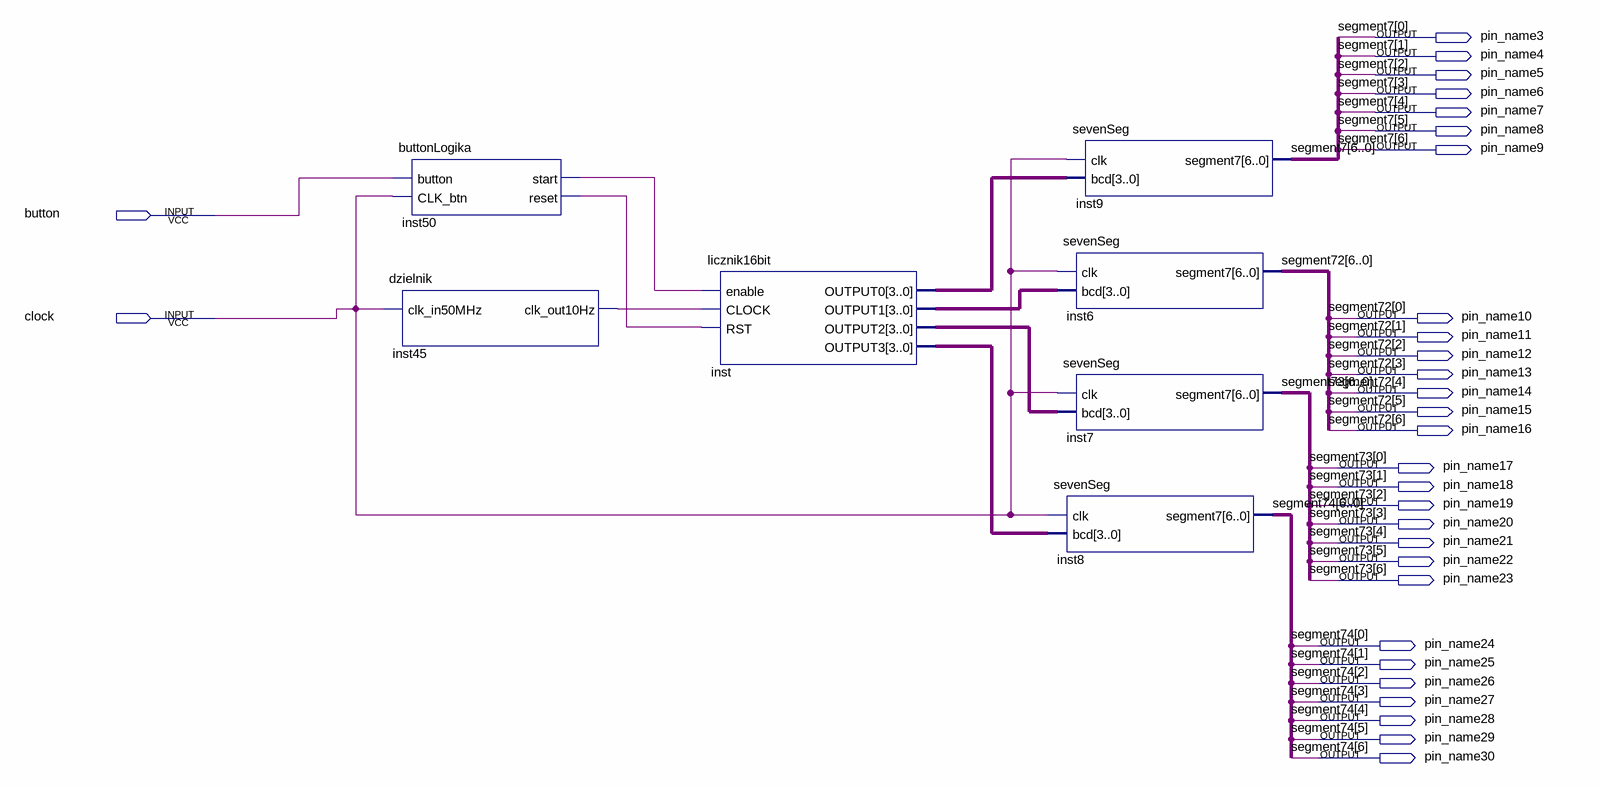
[diagram p0: schematic sheet]
// Quartus schematic Block1.bdf as structural Verilog: 7 symbols, 30 pins
module Block1 (
  input  button,
  input  clock,
  output pin_name3,
  output pin_name4,
  output pin_name5,
  output pin_name6,
  output pin_name7,
  output pin_name8,
  output pin_name9,
  output pin_name10,
  output pin_name11,
  output pin_name12,
  output pin_name13,
  output pin_name14,
  output pin_name15,
  output pin_name16,
  output pin_name17,
  output pin_name18,
  output pin_name19,
  output pin_name20,
  output pin_name21,
  output pin_name22,
  output pin_name23,
  output pin_name24,
  output pin_name25,
  output pin_name26,
  output pin_name27,
  output pin_name28,
  output pin_name29,
  output pin_name30
);

  wire inst45_clk_out10hz, inst50_reset, inst50_start;
  wire [3:0] inst_output0, inst_output1, inst_output2, inst_output3;

  buttonLogika inst50 (.button(button), .CLK_btn(clock), .start(inst50_start), .reset(inst50_reset));
  dzielnik inst45 (.clk_in50MHz(clock), .clk_out10Hz(inst45_clk_out10hz));
  licznik16bit inst (
    .enable(inst50_start), .CLOCK(inst45_clk_out10hz), .RST(inst50_reset), .OUTPUT0(inst_output0),
    .OUTPUT1(inst_output1), .OUTPUT2(inst_output2), .OUTPUT3(inst_output3));
  sevenSeg inst8 (
    .clk(clock), .bcd(inst_output3),
    .segment7({pin_name30, pin_name29, pin_name28, pin_name27, pin_name26, pin_name25, pin_name24}));
  sevenSeg inst9 (
    .clk(clock), .bcd(inst_output0),
    .segment7({pin_name9, pin_name8, pin_name7, pin_name6, pin_name5, pin_name4, pin_name3}));
  sevenSeg inst6 (
    .clk(clock), .bcd(inst_output1),
    .segment7({pin_name16, pin_name15, pin_name14, pin_name13, pin_name12, pin_name11, pin_name10}));
  sevenSeg inst7 (
    .clk(clock), .bcd(inst_output2),
    .segment7({pin_name23, pin_name22, pin_name21, pin_name20, pin_name19, pin_name18, pin_name17}));

  // Other names for the same wires on the sheet: segment7[6:0] = {pin_name9, pin_name8, pin_name7, pin_name6, pin_name5, pin_name4, pin_name3};
  //   segment72[6:0] = {pin_name16, pin_name15, pin_name14, pin_name13, pin_name12, pin_name11, pin_name10};
  //   segment73[6:0] = {pin_name23, pin_name22, pin_name21, pin_name20, pin_name19, pin_name18, pin_name17};
  //   segment74[6:0] = {pin_name30, pin_name29, pin_name28, pin_name27, pin_name26, pin_name25, pin_name24}
endmodule
